# EAGLE board EEZ PSU consolidated r5B9 (EAGLE 6.1), part 1 of 4
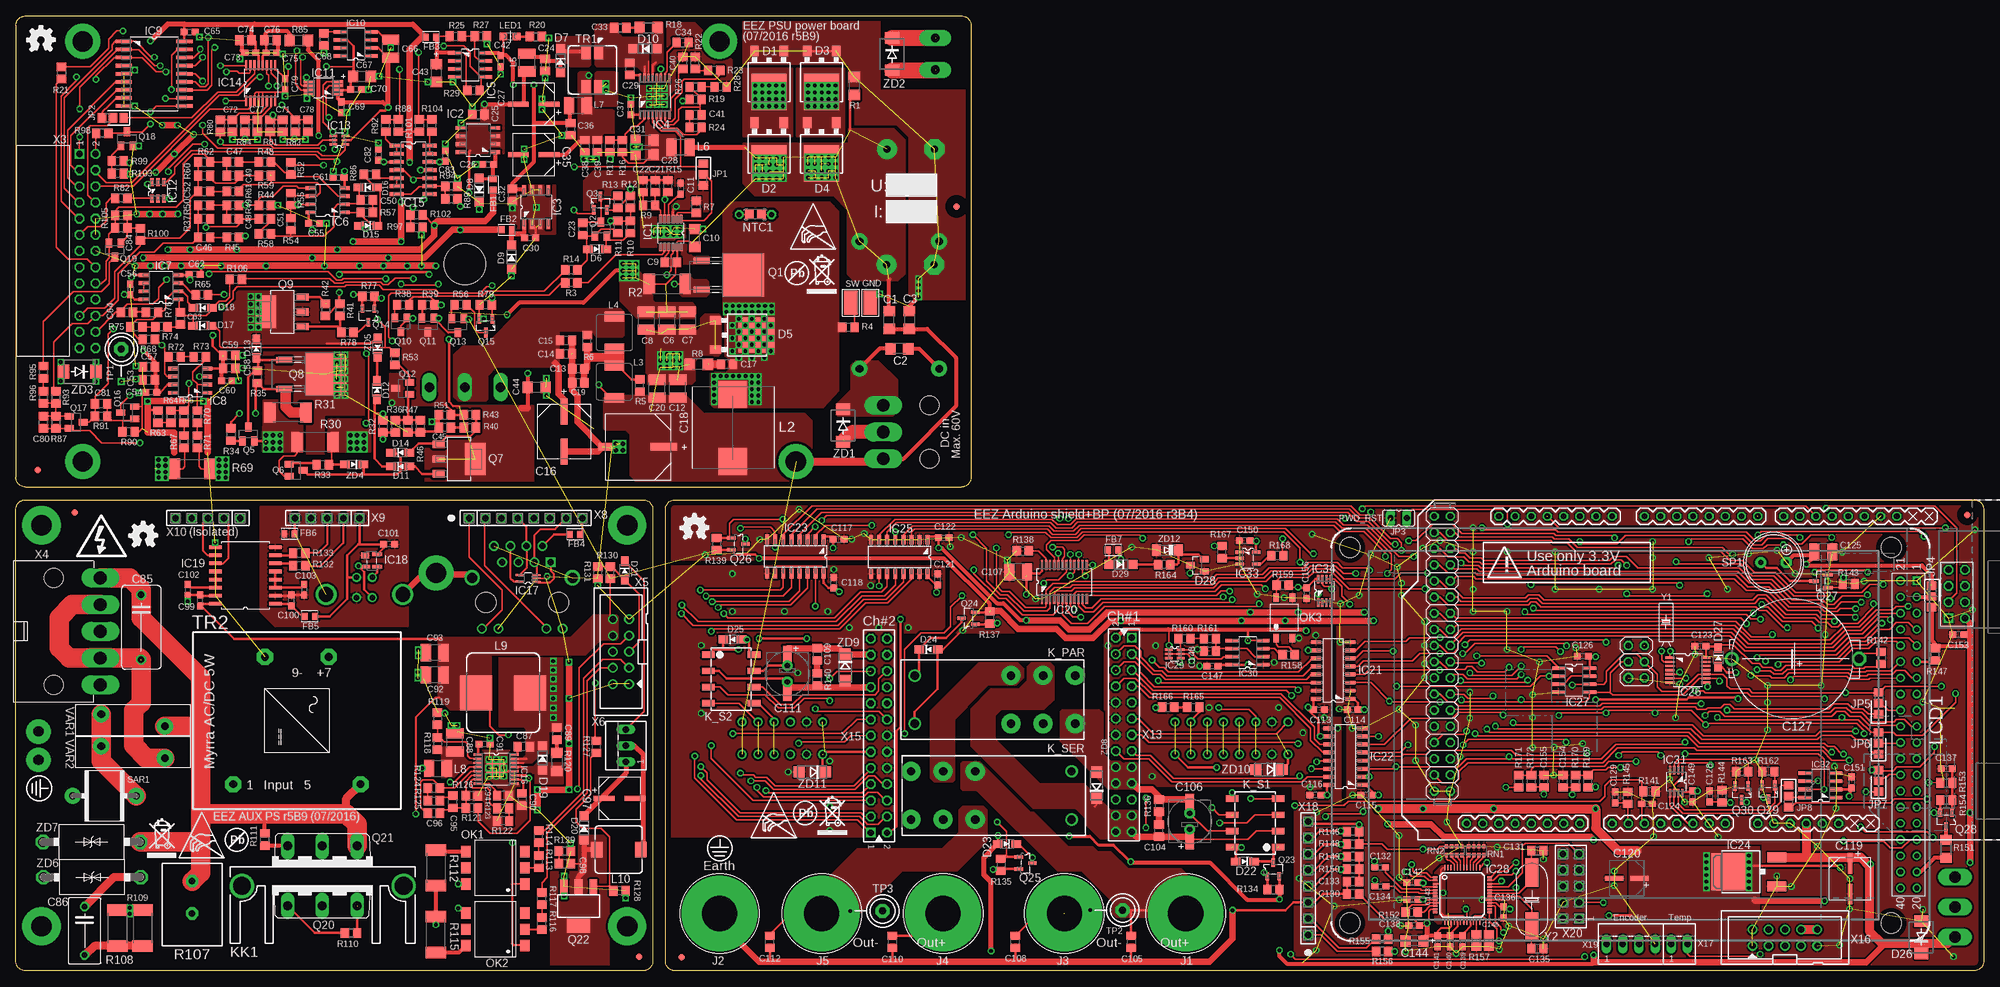
[diagram p12: board, top side]
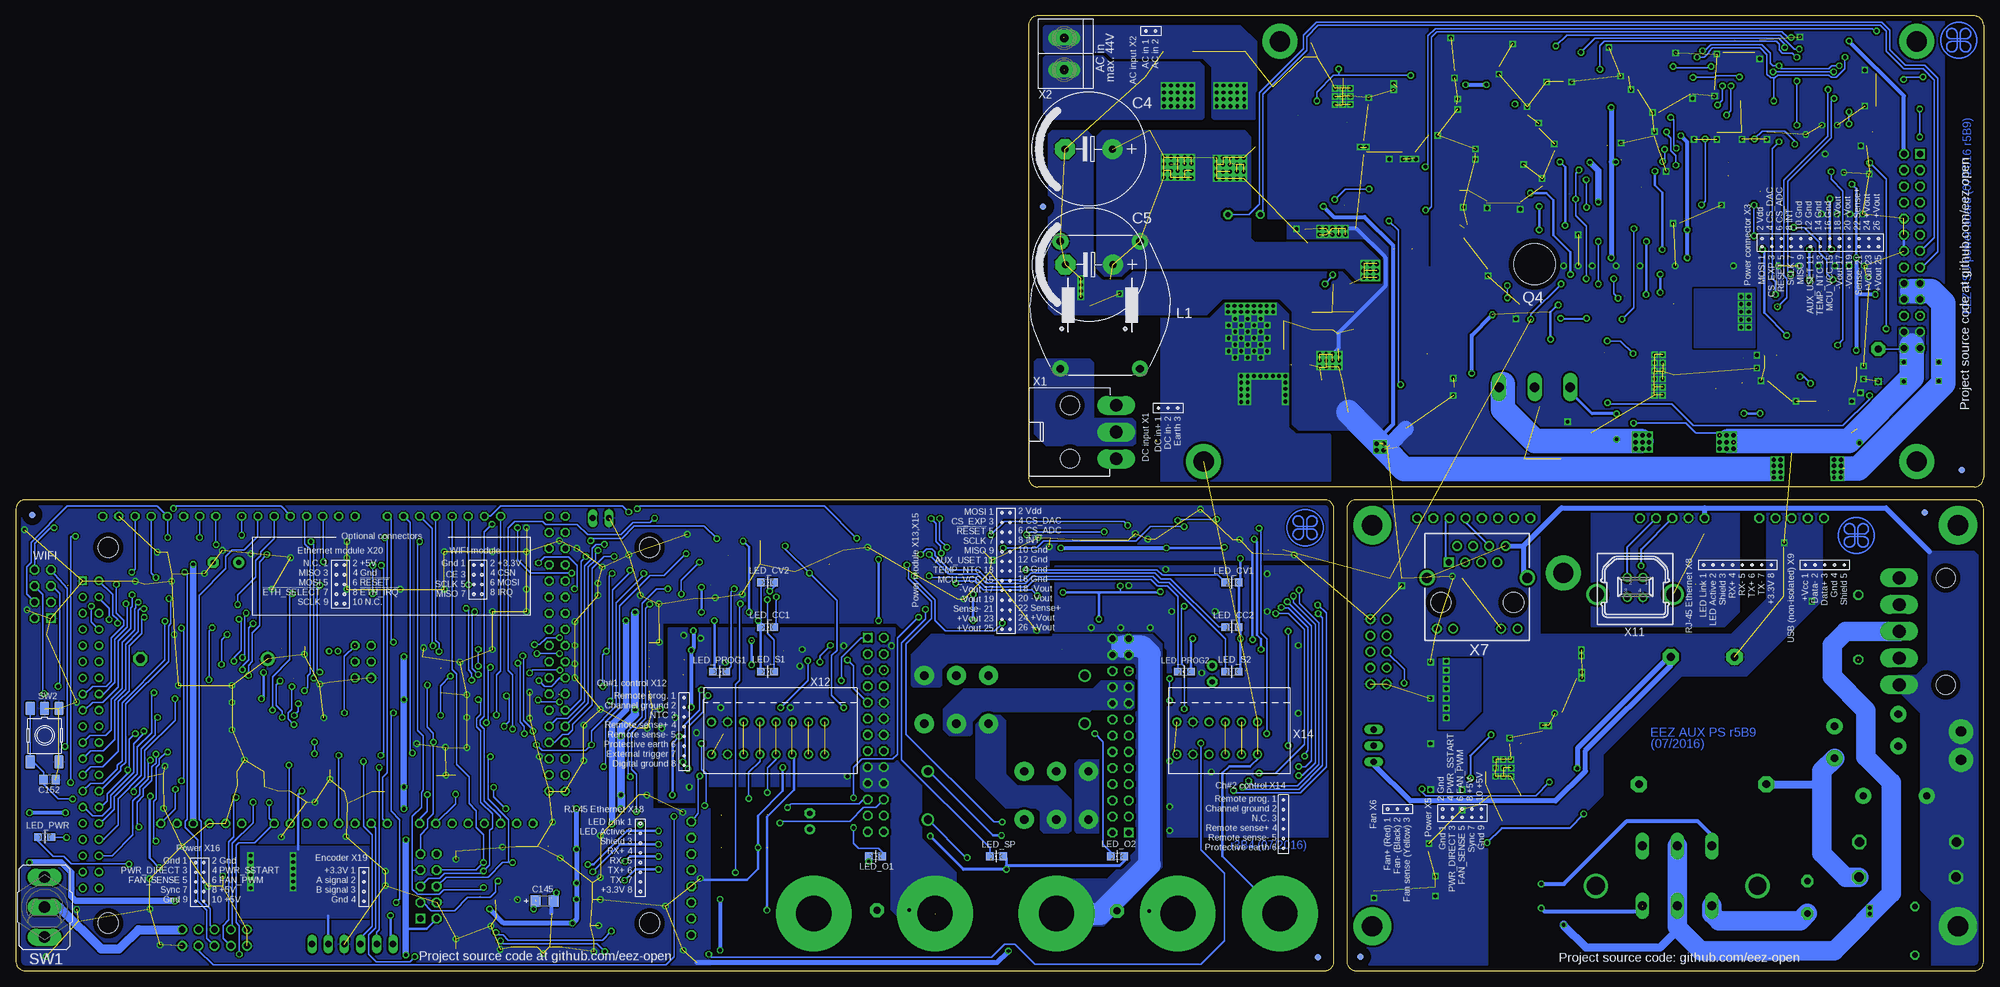
[diagram p13: board, bottom side, seen from below]

Size 309 x 150 mm. Coordinates in mm from the lower left corner, seen from the top.
Outline: 1.5,76 148.5,76 arc90 150,77.5 150,148.5 arc90 148.5,150 1.5,150 arc90 0,148.5 0,77.5 arc90 1.5,76
Outline: 1.5,74 98.5,74 arc-90 100,72.5 100,1.5 arc-90 98.5,0 1.5,0 arc-90 0,1.5 0,72.5 arc-90 1.5,74
Outline: 103.5,74 307.5,74 arc-90 309,72.5 309,1.5 arc-90 307.5,0 103.5,0 arc-90 102,1.5 102,72.5 arc-90 103.5,74
Copper layers (1*16): Top 0.035mm / dielectric 1.5mm / Bottom 0.035mm
Design rules: minimum track width 10mil, minimum drill 0.5mm, track to track 8mil, track to pad 8mil, pad to pad 8mil, via to via 8mil, smd to smd 8mil, copper to edge 30mil, drill to drill 8mil, minimum pad ring 10mil, minimum via ring 8mil, stop-mask expansion 4mil, vias tented up to drill 25mil, thermal gap 10mil
Net classes: 0 default: width 0.254 mm, drill 0.584 mm, clearance 0.254 mm; 1 dgnd: width 0.254 mm, drill 0.584 mm, clearance 0.254 mm; 2 gnd: width 0.254 mm, drill 0.584 mm, clearance 0.254 mm

## Footprints (pad centres in the part's own frame; a part is rotated, then mirrored left to right if it is on the bottom)
C1206 = smd 1.6 x 1.8: 1 -1.4,0; 2 1.4,0
ECAP7.5/18 = drill 1.1 pad 3.14: + -3.75,0 | drill 1.1 pad 3.14 octagon: - 3.75,0
C1210 = smd 1.6 x 2.7: 1 -1.4,0; 2 1.4,0
C0805 = smd 1.3 x 1.5: 1 -0.95,0; 2 0.95,0
C0603 = smd 1.1 x 1: 1 -0.85,0; 2 0.85,0
CAPAE830X1050N = smd 4.064 x 1.092: 1 -3.124,0; 2 3.124,0
PANASONIC_F = smd 4.166 x 1.194: 1 -4.064,0; 2 4.064,0
CAPAE660X610N = smd 3.251 x 0.762: 1 -2.413,0; 2 2.413,0
EC1206 = smd 1.6 x 1.8: + -1.4,0; - 1.4,0
C102-064X133 = drill 1.016 octagon: 1 -5.08,0; 2 5.08,0
C075-052X106 = drill 0.914 octagon: 1 -3.81,0; 2 3.81,0
CAPAE660X610N_COMBO2 = smd 3.6 x 1.4: 1 -2.6,0; 2 2.5,0 | drill 0.813 pad 1.6: 1.1 -1.27,0 | drill 0.813 pad 1.6 octagon: 2.1 1.27,0
PANASONIC_C = smd 2.87 x 0.762: 1 -1.981,0; 2 1.981,0
SG-R20MM = drill 1.3 pad 2.184 octagon: 1 10.389,0 | drill 1.3 pad 2.184: 2 -9.601,0
TO252@1 = smd 1.3 x 1.7: 1 -2.285,-5.49; 2 2.285,-5.49 | smd 5.5 x 5.7: 3 0,0.95
TO252 = smd 1.3 x 1.7: 1 -2.285,-5.49; 2 2.285,-5.49 | smd 5.5 x 5.7: 3 0,0.95
SOD323-W = smd 1.5 x 1.2: A 1.45,0; C -1.45,0
SOD123 = smd 1.4 x 1.4: A 1.9,0; C -1.9,0
DO214AA = smd 1.8 x 2.2: A 2.55,0; C -2.55,0
SOT23 = smd 1 x 1.4: 1 -0.95,-1.1; 2 0.95,-1.1; 3 0,1.1
BEAD0603 = smd 1 x 1.1: P$1 -0.85,0; P$2 0.85,0
FIDUCIAL_DUAL = smd 1.016 x 1.016 bottom: B 0,0 | smd 1.016 x 1.016: T 0,0
S1751-46R = smd 3.7 x 2.1: P$1 0,0
LTC_05-08-1666 = smd 1.27 x 0.457: 1 -2.235,1.63; 2 -2.235,0.98; 3 -2.235,0.33; 4 -2.235,-0.33; 5 -2.235,-0.98; 6 -2.235,-1.63; 7 2.235,-1.63; 8 2.235,-0.98; 9 2.235,-0.33; 10 2.235,0.33; 11 2.235,0.98; 12 2.235,1.63 | smd 1.753 x 2.946: TP 0,0
SOIC127P600X173-8N = smd 1.55 x 0.6: 1 -2.7,1.9; 2 -2.7,0.63; 3 -2.7,-0.64; 4 -2.7,-1.91; 5 2.7,-1.91; 6 2.7,-0.64; 7 2.7,0.63; 8 2.7,1.9
SOP65P640X110-16N = smd 1.422 x 0.356: 1 -2.845,2.286; 2 -2.845,1.626; 3 -2.845,0.965; 4 -2.845,0.33; 5 -2.845,-0.33; 6 -2.845,-0.965; 7 -2.845,-1.626; 8 -2.845,-2.286; 9 2.845,-2.286; 10 2.845,-1.626; 11 2.845,-0.965; 12 2.845,-0.33; 13 2.845,0.33; 14 2.845,0.965; 15 2.845,1.626; 16 2.845,2.286
SOIC127P600X175-8N = smd 1.981 x 0.559: 1 -2.464,1.905; 2 -2.464,0.635; 3 -2.464,-0.635; 4 -2.464,-1.905; 5 2.464,-1.905; 6 2.464,-0.635; 7 2.464,0.635; 8 2.464,1.905
SOIC127P1030X265-18N = smd 2.54 x 0.559: 1 -4.775,5.08; 2 -4.775,3.81; 3 -4.775,2.54; 4 -4.775,1.27; 5 -4.775,0; 6 -4.775,-1.27; 7 -4.775,-2.54; 8 -4.775,-3.81; 9 -4.775,-5.08; 10 4.775,-5.08; 11 4.775,-3.81; 12 4.775,-2.54; 13 4.775,-1.27; 14 4.775,0; 15 4.775,1.27; 16 4.775,2.54; 17 4.775,3.81; 18 4.775,5.08
DGK8-M = smd 1.727 x 0.483: 1 -2.235,0.965; 2 -2.235,0.33; 3 -2.235,-0.33; 4 -2.235,-0.965; 5 2.235,-0.965; 6 2.235,-0.33; 7 2.235,0.33; 8 2.235,0.965
SOT95P280X145-6N = smd 1.27 x 0.559: 1 -1.295,0.94; 2 -1.295,0; 3 -1.295,-0.94; 4 1.295,-0.94; 5 1.295,0; 6 1.295,0.94
SOT65P210X110-6N = smd 1.168 x 0.356: 1 -0.94,0.66; 2 -0.94,0; 3 -0.94,-0.66; 4 0.94,-0.66; 5 0.94,0; 6 0.94,0.66
PW(R-PDSO-G16) = smd 1.6 x 0.35: 1 -2.8,2.3; 2 -2.8,1.65; 3 -2.8,1; 4 -2.8,0.35; 5 -2.8,-0.3; 6 -2.8,-0.95; 7 -2.8,-1.6; 8 -2.8,-2.25; 9 2.8,-2.25; 10 2.8,-1.6; 11 2.8,-0.95; 12 2.8,-0.3; 13 2.8,0.35; 14 2.8,1; 15 2.8,1.65; 16 2.8,2.3
SOIC127P600X175-14N = smd 2.2 x 0.6: 1 -2.591,3.81; 2 -2.591,2.54; 3 -2.591,1.27; 4 -2.591,0; 5 -2.591,-1.27; 6 -2.591,-2.54; 7 -2.591,-3.81; 8 2.591,-3.81; 9 2.591,-2.54; 10 2.591,-1.27; 11 2.591,0; 12 2.591,1.27; 13 2.591,2.54; 14 2.591,3.81
SOP65P640X110-17N = smd 1.422 x 0.356: 1 -2.845,2.286; 2 -2.845,1.626; 3 -2.845,0.965; 4 -2.845,0.33; 5 -2.845,-0.33; 6 -2.845,-0.965; 7 -2.845,-1.626; 8 -2.845,-2.286; 9 2.845,-2.286; 10 2.845,-1.626; 11 2.845,-0.965; 12 2.845,-0.33; 13 2.845,0.33; 14 2.845,0.965; 15 2.845,1.626; 16 2.845,2.286 | smd 2.997 x 2.997: TP 0,0
SOT50P280X60-5N = smd 1.118 x 0.254: 1 -1.372,0.508; 2 -1.372,0; 3 -1.372,-0.508 | smd 1.118 x 0.305: 4 1.372,-0.508; 5 1.372,0.508
SOP192P292X122-4N = smd 0.94 x 1.321: 1 -0.762,-1.016 | smd 0.559 x 1.575: 2 0.965,-1.016; 3 0.965,0.889; 4 -0.965,0.889
SOIC-16W = smd 1.981 x 0.559: 1 -4.699,4.445; 2 -4.699,3.175; 3 -4.699,1.905; 4 -4.699,0.635; 5 -4.699,-0.635; 6 -4.699,-1.905; 7 -4.699,-3.175; 8 -4.699,-4.445; 9 4.699,-4.445; 10 4.699,-3.175; 11 4.699,-1.905; 12 4.699,-0.635; 13 4.699,0.635; 14 4.699,1.905; 15 4.699,3.175; 16 4.699,4.445
SOP63P600X175-24N = smd 1.6 x 0.356: 1 -2.667,3.505; 2 -2.667,2.845; 3 -2.667,2.235; 4 -2.667,1.575; 5 -2.667,0.965; 6 -2.667,0.305; 7 -2.667,-0.305; 8 -2.667,-0.965; 9 -2.667,-1.575; 10 -2.667,-2.235; 11 -2.667,-2.845; 12 -2.667,-3.505; 13 2.667,-3.505; 14 2.667,-2.845; 15 2.667,-2.235; 16 2.667,-1.575; 17 2.667,-0.965; 18 2.667,-0.305; 19 2.667,0.305; 20 2.667,0.965; 21 2.667,1.575; 22 2.667,2.235; 23 2.667,2.845; 24 2.667,3.505
SOIC-16 = smd 1.549 x 0.61: 1 -2.692,4.445; 2 -2.692,3.175; 3 -2.692,1.905; 4 -2.692,0.635; 5 -2.692,-0.635; 6 -2.692,-1.905; 7 -2.692,-3.175; 8 -2.692,-4.445; 9 2.692,-4.445; 10 2.692,-3.175; 11 2.692,-1.905; 12 2.692,-0.635; 13 2.692,0.635; 14 2.692,1.905; 15 2.692,3.175; 16 2.692,4.445
DPACK = smd 1.6 x 3: 1 -2.28,-4.8; 3 2.28,-4.8 | smd 5.8 x 6.2: 4 0,2.38
SOP65P640X120-14N = smd 1.473 x 0.356: 1 -2.819,1.956; 2 -2.819,1.295; 3 -2.819,0.66; 4 -2.819,0; 5 -2.819,-0.66; 6 -2.819,-1.295; 7 -2.819,-1.956; 8 2.819,-1.956; 9 2.819,-1.295; 10 2.819,-0.66; 11 2.819,0; 12 2.819,0.66; 13 2.819,1.295; 14 2.819,1.956
TQFP48-7X7 = smd 0.85 x 0.32: 1 -4.275,2.75; 2 -4.275,2.25; 3 -4.275,1.75; 4 -4.275,1.25; 5 -4.275,0.75; 6 -4.275,0.25; 7 -4.275,-0.25; 8 -4.275,-0.75; 9 -4.275,-1.25; 10 -4.275,-1.75; 11 -4.275,-2.25; 12 -4.275,-2.75; 25 4.275,-2.75; 26 4.275,-2.25; 27 4.275,-1.75; 28 4.275,-1.25; 29 4.275,-0.75; 30 4.275,-0.25; 31 4.275,0.25; 32 4.275,0.75; 33 4.275,1.25; 34 4.275,1.75; 35 4.275,2.25; 36 4.275,2.75 | smd 0.32 x 0.85: 13 -2.75,-4.275; 14 -2.25,-4.275; 15 -1.75,-4.275; 16 -1.25,-4.275; 17 -0.75,-4.275; 18 -0.25,-4.275; 19 0.25,-4.275; 20 0.75,-4.275; 21 1.25,-4.275; 22 1.75,-4.275; 23 2.25,-4.275; 24 2.75,-4.275; 37 2.75,4.275; 38 2.25,4.275; 39 1.75,4.275; 40 1.25,4.275; 41 0.75,4.275; 42 0.25,4.275; 43 -0.25,4.275; 44 -0.75,4.275; 45 -1.25,4.275; 46 -1.75,4.275; 47 -2.25,4.275; 48 -2.75,4.275
SOP65P400X130-8N = smd 1.321 x 0.356: 1 -1.829,0.965; 2 -1.829,0.33; 3 -1.829,-0.33; 4 -1.829,-0.965; 5 1.829,-0.965; 6 1.829,-0.33; 7 1.829,0.33; 8 1.829,0.965
SOT95P280X145-5N = smd 1.27 x 0.559: 1 -1.295,0.94; 2 -1.295,0; 3 -1.295,-0.94; 4 1.295,-0.94; 5 1.295,0.94
BP_5_12 = drill 5.5 pad 11.9: P$1 0,0
A0R-JMP = smd 1.5 x 1.3: 1 0,1.7; 2 0,0; 3 0,-1.7
JP1 = drill 0.914 long: 1 0,-1.27; 2 0,1.27
RT-C/016A5_ROUND = drill 1.3 pad 3: 11A 8.83,3.78; 11B 8.83,-3.78; 12A 3.79,3.78; 12B 3.79,-3.78; 14A 13.87,3.78; 14B 13.87,-3.78 | drill 1.3: A1 -11.33,-3.78; A2 -11.33,3.78
G6K-2F = smd 1 x 2: 1 -3.81,-3.6; 2 -1.27,-3.6; 3 1.27,-3.6; 4 3.81,-3.6; 5 3.81,3.6; 6 1.27,3.6; 7 -1.27,3.6; 8 -3.81,3.6
SK145 = drill 2.8: 1 -12.7,0; 2 12.7,0
RN114 = drill 1.2 pad 2.54: 1 -10,6.25; 2 -10,-6.25; 3 10,-6.25; 4 10,6.25
WE-HCI_1350/1365 = smd 4.25 x 4.5: 1 -5.25,0; 2 5.27,0
IHLP-2020BZ-11 = smd 3.048 x 1.524: 1 0,2.515; 2 0,-2.515
L1210 = smd 1.6 x 2.7: 1 -1.4,0; 2 1.4,0
MSS1278 = smd 5.5 x 5: 1 0,4.25; 2 0,-4.25
DE0704 = smd 2.5 x 1.8: 1 0,3.45; 2 0,-3.45
LCD_TFT_320QVT_MIRROR = drill 0.8 square: 1 48.26,0 | drill 0.8: 2 45.72,0; 3 43.18,0; 4 40.64,0; 5 38.1,0; 6 35.56,0; 7 33.02,0; 8 30.48,0; 9 27.94,0; 10 25.4,0; 11 22.86,0; 12 20.32,0; 13 17.78,0; 14 15.24,0; 15 12.7,0; 16 10.16,0; 17 7.62,0; 18 5.08,0; 19 2.54,0; 20 0,0; 21 48.26,2.54; 22 45.72,2.54; 23 43.18,2.54; 24 40.64,2.54; 25 38.1,2.54; 26 35.56,2.54; 27 33.02,2.54; 28 30.48,2.54; 29 27.94,2.54; 30 25.4,2.54; 31 22.86,2.54; 32 20.32,2.54; 33 17.78,2.54; 34 15.24,2.54; 35 12.7,2.54; 36 10.16,2.54; 37 7.62,2.54; 38 5.08,2.54; 39 2.54,2.54; 40 0,2.54 | hole 3.2: -5.5,4; 53.5,4; -5.5,89; 53.5,89
LED_0805 = smd 1.2 x 1.2: A 0,-1.05; C 0,1.05
ARDUINO+ICSP_MIRROR = drill 0.9 octagon: 0 63.5,2.54; 1 60.96,2.54; 2 58.42,2.54; 3 55.88,2.54; 3.3V 35.56,50.8; 4 53.34,2.54; 5 50.8,2.54; 5V 38.1,50.8; 5V(1) 93.98,2.54; 5V(2) 96.52,2.54; 6 48.26,2.54; 7 45.72,2.54; 8 41.656,2.54; 9 39.116,2.54; 10 36.576,2.54; 11 34.036,2.54; 12 31.496,2.54; 13 28.956,2.54; 14 68.58,2.54; 15 71.12,2.54; 16 73.66,2.54; 17 76.2,2.54; 18 78.74,2.54; 19 81.28,2.54; 20 83.82,2.54; 21 86.36,2.54; 22 93.98,5.08; 23 96.52,5.08; 24 93.98,7.62; 25 96.52,7.62; 26 93.98,10.16; 27 96.52,10.16; 28 93.98,12.7; 29 96.52,12.7; 30 93.98,15.24; 31 96.52,15.24; 32 93.98,17.78; 33 96.52,17.78; 34 93.98,20.32; 35 96.52,20.32; 36 93.98,22.86; 37 96.52,22.86; 38 93.98,25.4; 39 96.52,25.4; 40 93.98,27.94; 41 96.52,27.94; 42 93.98,30.48; 43 96.52,30.48; 44 93.98,33.02; 45 96.52,33.02; 46 93.98,35.56; 47 96.52,35.56; 48 93.98,38.1; 49 96.52,38.1; 50 93.98,40.64; 51 96.52,40.64; 52 93.98,43.18; 53 96.52,43.18; A0 50.8,50.8; A1 53.34,50.8; A2 55.88,50.8; A3 58.42,50.8; A4 60.96,50.8; A5 63.5,50.8; A6 66.04,50.8; A7 68.58,50.8; A8 73.66,50.8; A9 76.2,50.8; A10 78.74,50.8; A11 81.28,50.8; A12 83.82,50.8; A13 86.36,50.8; A14 88.9,50.8; A15 91.44,50.8; AREF 23.876,2.54; GND 26.416,2.54; GND1 40.64,50.8; GND2 43.18,50.8; GND3 93.98,45.72; GND4 96.52,45.72; ICSP_+5V 66.04,22.86; ICSP_MISO 63.5,22.86; ICSP_MOSI 66.04,25.4; ICSP_RESET 63.5,27.94; ICSP_SCK 63.5,25.4; RESET 33.02,50.8; VIN 45.72,50.8 | drill 1.016 octagon: ICSP_GND 66.04,27.94
R_0204/5+0805 = smd 1.3 x 1.5: 1 -0.95,0; 2 0.95,0 | drill 0.813 octagon: 1.1 -2.54,0 | drill 0.8 pad 1.422 octagon: 2.1 2.54,0
DIL6-SMD = smd 1.78 x 1.52: 1 -2.54,-4.645; 2 0,-4.645; 3 2.54,-4.645; 4 2.54,4.645; 5 0,4.645; 6 -2.54,4.645
HCPL-181 = smd 0.889 x 1.27: 1 -1.27,-3.175; 2 1.27,-3.175; 3 1.27,3.175; 4 -1.27,3.175
TO229P990X239-3N = smd 0.94 x 2.489: 1 -2.286,-6.401; 3 2.286,-6.401 | smd 6.731 x 6.528: 2 0,0.152
SOT23-BEC = smd 1 x 1.4: B -0.95,-1.1; C 0,1.1; E 0.95,-1.1
SOT103P240X110-3N = smd 1.524 x 0.559: 1 -1.079,1.016; 2 -1.079,-1.016; 3 1.079,0
TO247BH-CLR = drill 1.499 long: D 0,-19.304; G -5.588,-19.304; S 5.588,-19.304 | hole 6.5: 0,0
SOT230P700X180-4N = smd 1.905 x 1.143: 1 -3.2,2.311; 2 -3.2,0; 3 -3.2,-2.311 | smd 3.175 x 5.08: 4 2.565,0
SOT95P237X112-3N = smd 1.321 x 0.559: 1 -1.092,0.94; 2 -1.092,-0.94; 3 1.092,0
TOP3S-1 = drill 1.397 long: A1 -5.461,-3.175; A2 0,-3.175; G 5.461,-3.175
SOT223 = smd 1.219 x 2.235: 1 -2.311,-3.099; 2 0,-3.099; 3 2.311,-3.099 | smd 3.6 x 2.2: 4 0,3.099
R1206 = smd 1.6 x 1.803: 1 -1.422,0; 2 1.422,0
R2512 = smd 1.8 x 3.2: 1 -2.8,0; 2 2.8,0
R0805 = smd 1.3 x 1.5: 1 -0.95,0; 2 0.95,0
R_0913 = drill 1.016 pad 1.93 octagon: 1 -3.556,0; 2 1.524,0
CAY16 = smd 0.5 x 0.65: 1 -1.2,-0.675; 2 -0.4,-0.675; 3 0.4,-0.675; 4 1.2,-0.675; 5 1.2,0.675; 6 0.4,0.675; 7 -0.4,0.675; 8 -1.2,0.675
SAR = drill 1.1 pad 2.54: P$1 0,0; P$2 10,0
SHORT_NOHOLE = smd 0.5 x 0.25 bottom: P$1 0,0.117; P$2 0,-0.117
LD-BZEN-0903 = drill 0.8 pad 1.778 octagon: +B 2,0 | drill 0.8 pad 1.778: -B -2,0
M9040P = drill 1.803 long: 1 0,4.699; 2 0,0; 3 0,-4.699
TACTM-6XN = smd 2.1 x 1.4: 1 -4.2,2.25; 2 4.2,2.25; 3 -4.2,-2.25; 4 4.2,-2.25; 5 -4.2,0
TP_1.1MM = drill 0.6 square: GND 5.08,0 | drill 1.1 pad 2.184 octagon: TIP 0,0
SRF0703 = smd 1.4 x 2.1: 1 1,2.7; 2 -1,2.7; 3 -1,-2.7; 4 1,-2.7
PCB_ACDC_MYRRA_5W = drill 1.2 pad 2.54 octagon: 1 10,-10; 5 10,10; 7 -10,5; 9 -10,-5
VARISTOR = drill 1.2 pad 2.54: P$1 -5,0.95; P$2 5,-0.95
MOD-NRF24L01_MIRROR = drill 1 pad 1.5 square: 1 0,0 | drill 1 pad 1.5 octagon: 2 2.54,0; 3 0,2.54; 4 2.54,2.54; 5 0,5.08; 6 2.54,5.08; 7 0,7.62; 8 2.54,7.62
MINIFIT_6659-3 = drill 2 pad 2.54 long: 1 0,0; 2 0,-4.2; 3 0,-8.4 | hole 3: -7.3,0; -7.3,-8.4
TBLOCK5.0_2 = drill 1.35 pad 2.54 long: 1 0,0; 2 0,-5
SSW-113-02-T-D-RA = drill 1 pad 1.5 square: 1 30.48,2.54 | drill 1 pad 1.5 octagon: 2 30.48,0; 3 27.94,2.54; 4 27.94,0; 5 25.4,2.54; 6 25.4,0; 7 22.86,2.54; 8 22.86,0; 9 20.32,2.54; 10 20.32,0; 11 17.78,2.54; 12 17.78,0; 13 15.24,2.54; 14 15.24,0; 15 12.7,2.54; 16 12.7,0; 17 10.16,2.54; 18 10.16,0; 19 7.62,2.54; 20 7.62,0; 21 5.08,2.54; 22 5.08,0; 23 2.54,2.54; 24 2.54,0; 25 0,2.54; 26 0,0
MINIFIT_6659-5 = drill 2 pad 2.54 long: 1 0,0; 2 0,-4.2; 3 0,-8.4; 4 0,-12.6; 5 0,-16.8 | hole 3: -7.3,0; -7.3,-16.8
IDC-10PIN = drill 1 pad 1.422: 1 -5.08,-1.27; 2 -5.08,1.27; 3 -2.54,-1.27; 4 -2.54,1.27; 5 0,-1.27; 6 0,1.27; 7 2.54,-1.27; 8 2.54,1.27; 9 5.08,-1.27; 10 5.08,1.27
22-23-2031 = drill 1 long: 1 -2.54,0; 2 0,0; 3 2.54,0
RJ45-VERT = drill 1 square: 1 4.445,-5.08 | drill 1: 2 3.175,-7.62; 3 1.905,-5.08; 4 0.635,-7.62; 5 -0.635,-5.08; 6 -1.905,-7.62; 7 -3.175,-5.08; 8 -4.445,-7.62; 9 6.325,5.38; 10 3.785,5.38; 11 -3.785,5.38; 12 -6.325,5.38 | drill 1.6: SH1 7.875,-2.62; SH2 -7.875,-2.62 | hole 3.2: -5.715,1.27; 5.715,1.27
SSW-108-02-S-S = drill 1 pad 1.5 octagon: 1 -8.89,0; 2 -6.35,0; 3 -3.81,0; 4 -1.27,0; 5 1.27,0; 6 3.81,0; 7 6.35,0; 8 8.89,0
SSW-105-02-S-S = drill 1 pad 1.5 octagon: 1 -5.08,0; 2 -2.54,0; 3 0,0; 4 2.54,0; 5 5.08,0
KUSBVX-BS1N = drill 0.9 pad 1.422: 1 1.25,2.7; 2 -1.25,2.7; 3 -1.25,-0.5; 4 1.25,-0.5 | drill 2.3 pad 2.7: M1 -6.02,0; M2 6.02,0
MC000006_MIRROR = drill 0.9: 1 0,0; 1.1 0,-5.08; 2 -2.54,0; 2.1 -2.54,-5.08; 3 -5.08,0; 3.1 -5.08,-5.08; 4 -7.62,0; 4.1 -7.62,-5.08; 5 -10.16,0; 5.1 -10.16,-5.08; 6 -12.7,0; 6.1 -12.7,-5.08; 7 -15.24,0; 7.1 -15.24,-5.08; 8 -17.78,0; 8.1 -17.78,-5.08
TSW-113-07-F-D = drill 1 pad 1.5 square: 1 30.48,0 | drill 1 pad 1.5 octagon: 2 30.48,2.54; 3 27.94,0; 4 27.94,2.54; 5 25.4,0; 6 25.4,2.54; 7 22.86,0; 8 22.86,2.54; 9 20.32,0; 10 20.32,2.54; 11 17.78,0; 12 17.78,2.54; 13 15.24,0; 14 15.24,2.54; 15 12.7,0; 16 12.7,2.54; 17 10.16,0; 18 10.16,2.54; 19 7.62,0; 20 7.62,2.54; 21 5.08,0; 22 5.08,2.54; 23 2.54,0; 24 2.54,2.54; 25 0,0; 26 0,2.54
MC000005_MIRROR = drill 0.9: 1 0,0; 1.1 0,-5.08; 2 -2.54,0; 2.1 -2.54,-5.08; 3 -5.08,0; 3.1 -5.08,-5.08; 4 -7.62,0; 4.1 -7.62,-5.08; 5 -10.16,0; 5.1 -10.16,-5.08; 6 -12.7,0; 6.1 -12.7,-5.08
22-23-2021 = drill 1 long: 1 -1.27,0; 2 1.27,0
22-23-2041 = drill 1 long: 1 -3.81,0; 2 -1.27,0; 3 1.27,0; 4 3.81,0
SSW-105-02-S-D = drill 1 pad 1.5 square: 1 -5.08,-1.27 | drill 1 pad 1.5 octagon: 2 -5.08,1.27; 3 -2.54,-1.27; 4 -2.54,1.27; 5 0,-1.27; 6 0,1.27; 7 2.54,-1.27; 8 2.54,1.27; 9 5.08,-1.27; 10 5.08,1.27
R26_XTAL = drill 0.5: 1 -0.7,0; 2 0.7,0
HC-49/4H = smd 4.5 x 2: 1 -4.25,0; 2 4.25,0
DO201-BIDIR = drill 1.499 octagon: A 7.62,0; C -7.62,0
DO214AC = smd 1.8 x 1.7: A 2.05,0; C -2.05,0
MINIMELF = smd 1.4 x 1.8: A 1.7,0; C -1.7,0

## Placement (x,y rotation side)
C1  4n7/100V  [C1206]  137.15,102.23 90 top
C2  4n7/100V  [C1206]  138.73,97.73 180 top
C3  4n7/100V  [C1206]  140.32,102.23 270 top
C4  2m2  [ECAP7.5/18]  140.51,129.1 180 bottom
C5  2m2  [ECAP7.5/18]  140.45,110.93 180 bottom
C6  4u7  [C1210]  102.22,102.11 270 top
C7  4u7  [C1210]  105.46,102.11 270 top
C8  4u7  [C1210]  98.98,102.11 270 top
C9  470n  [C0805]  102.86,111.32 0 top
C10  1u/100V  [C1206]  106.6,115.13 90 top
C11  100n  [C0603]  104.38,122.87 270 top
C12  10u  [C1210]  103.93,91.44 90 top
C13  1u  [C0805]  88.31,94.55 180 top
C14  n.c.  [C0805]  86.41,96.9 0 top
C15  n.c.  [C0805]  86.41,99.06 0 top
C16  EEEFK1J470P  [CAPAE830X1050N]  86.09,84.71 270 top
C17  330p  [C0805]  111.68,95.25 180 top
C18  EEEFK1J101P  [PANASONIC_F]  97.71,82.3 180 top
C19  n.c.  [C0805]  88.31,92.39 0 top
C20  10u  [C1210]  100.7,91.44 90 top
C21  120p  [C0805]  100.44,123.25 90 top
C22  4n7  [C0805]  98.47,123.25 90 top
C23  470p  [C0805]  89.01,116.52 270 top
C24  2u2  [C0805]  83.11,142.3 270 top
C25  470n  [C0805]  72.63,134.49 0 top
C26  100n  [C0603]  74.15,126.68 0 top
C27  47u  [CAPAE660X610N]  81.33,136.14 180 top
C28  1u/100V  [C1206]  98.73,128.21 180 top
C29  22n  [C0805]  96.44,141.67 270 top
C30  100n  [C0603]  80.76,115.13 0 top
C31  1u/100V  [C1206]  98.73,130.43 180 top
C32  470n  [C0805]  77.96,121.86 270 top
C33  330p  [C0805]  94.92,148.15 0 top
C34  10n  [C0805]  104.7,145.8 0 top
C35  47u  [CAPAE660X610N]  81.33,128.21 180 top
C36  2u2  [C0805]  87.11,132.21 270 top
C37  100n  [C0603]  96.57,135.32 270 top
C38  2u2  [C0805]  89.33,129.54 270 top
C39  n.c.  [C0805]  91.3,129.54 270 top
C40  3n3  [C0805]  104.7,142.62 270 top
C41  1n  [C0805]  106.73,134.43 180 top
C42  100n  [C0603]  76.12,142.88 270 top
C43  4u7  [EC1206]  66.03,141.03 270 top
C44  1u/100V  [C1206]  81.77,91.69 0 top
C45  10n  [C0805]  67.36,85.34 180 top
C46  47p  [C0805]  29.58,115.19 0 top
C47  2n2  [C0805]  34.08,127.06 0 top
C48  2n2  [C0805]  34.08,118.11 0 top
C49  2n2  [C0805]  34.08,124.9 180 top
C50  120p  [C0805]  55.1,121.09 0 top
C51  2n2  [C0805]  39.1,118.11 0 top
C52  47p  [C0805]  29.58,122.42 0 top
C53  10n  [C0805]  20.88,92.87 0 top
C54  100n  [C0603]  21.26,90.87 180 top
C55  100n  [C0603]  46.85,117.41 180 top
C56  100n  [C0603]  17.96,107.06 270 top
C57  1u  [C0805]  20.89,94.85 0 top
C58  10n  [C0805]  33.51,94.68 180 top
C59  1u  [C0805]  33.51,96.66 180 top
C60  100n  [C0603]  33.13,92.71 0 top
C61  100n  [C0603]  50.66,124.65 0 top
C62  100n  [C0603]  28.05,109.41 180 top
C63  1n  [C0805]  25.83,102.49 90 top
C64  1n  [C0805]  17.45,103.44 0 top
C65  100n  [C0603]  27.29,147.45 0 top
C66  10u  [C1210]  58.85,144.84 90 top
C67  10u  [EC1206]  54.34,140.53 0 top
C68  1u  [C0805]  48.37,146.3 270 top
C69  100n  [C0603]  51.1,135.64 90 top
C70  100n  [C0603]  53.45,138.43 180 top
C71  3n3  [C0805]  41.9,132.72 90 top
C72  3n3  [C0805]  34.02,132.72 270 top
C73  100n  [C0603]  36.81,144.21 0 top
C74  1u  [C0805]  36.05,146.18 0 top
C75  100n  [C0603]  40.12,144.21 180 top
C76  1u  [C0805]  39.99,146.18 180 top
C77  3n3  [C0805]  37.96,132.72 90 top
C78  3n3  [C0805]  45.83,132.72 90 top
C79  100n  [C0603]  42.28,139.26 90 top
C80  10n  [C0805]  4.3,86.17 90 top
C81  2n2  [C0805]  13.38,89.09 180 top
C82  100n  [C0603]  56.94,128.21 270 top
C83  100n  [C0603]  67.42,128.02 270 top
C84  10n  [C0805]  16.56,116.71 180 top
C85  6n8 (X1)  [C102-064X133]  19.67,53.98 270 top
C86  47n/400V  [C075-052X106]  10.78,6.29 270 top
C87  22n  [C0805]  79.74,35.24 180 top
C88  4u7  [C1210]  68.95,35.88 90 top
C89  330p  [C0805]  84.95,37.27 270 top
C90  22n  [C0805]  79.49,26.92 270 top
C91  100n  [C0603]  73.58,35.62 180 top
C92  4u7  [C1210]  65.77,46.48 180 top
C93  4u7  [C1210]  65.77,49.97 180 top
C94  1n  [C0805]  76.5,27.56 180 top
C95  3n9  [C0805]  68.63,26.57 90 top
C96  180p  [C0805]  65.64,24.77 180 top
C97  100u  [CAPAE660X610N]  94.79,27.11 0 top
C98  47n  [C0805]  86.22,16.83 0 top
C99  100n  [C0603]  28.94,58.17 90 top
C100  100n  [C0603]  43.29,58.17 90 top
C101  100n  [C0603]  58.6,66.99 180 top
C102  100n  [C0603]  26.97,59.82 270 top
C103  100n  [C0603]  45.26,59.88 270 top
C104  470n  [C0805]  179.5,22.03 90 top
C105  4n7/200V  [C0805]  175.12,4.57 270 top
C106  EEEFK1J220P  [CAPAE660X610N_COMBO2]  184.33,23.5 90 top
C107  10u  [C1210]  157.4,62.67 180 top
C108  4n7/200V  [C0805]  156.96,4.57 90 top
C109  470n  [C0805]  125.84,49.72 270 top
C110  4n7/200V  [C0805]  137.65,4.57 270 top
C111  EEEFK1J220P  [CAPAE660X610N_COMBO2]  121.14,46.67 270 top
C112  4n7/200V  [C0805]  118.41,4.57 90 top
C113  100n  [C0603]  204.65,41.02 0 top
C114  100n  [C0603]  209.92,41.02 180 top
C115  100n  [C0603]  212.07,27.62 180 top
C116  100n  [C0603]  204.07,27.62 180 top
C117  100n  [C0603]  129.21,67.82 0 top
C118  100n  [C0603]  128.45,60.96 90 top
C119  47u  [CAPAE660X610N]  288.02,14.48 270 top
C120  10u  [PANASONIC_C]  252.97,14.54 180 top
C121  100n  [C0603]  144.76,61.47 90 top
C122  100n  [C0603]  145.72,68.01 0 top
C123  100n  [C0603]  264.53,50.99 0 top
C124  100n  [C0603]  256.14,26.23 180 top
C125  10u  [C1210]  283.83,65.79 180 top
C126  100n  [C0603]  246.05,49.4 180 top
C127  EECS5R5H105  [SG-R20MM]  279.07,49.02 0 top
C128  100n  [C0603]  265.99,27.43 270 top
C129  100n  [C0603]  251.13,27.24 270 top
C130  22n  [C0805]  209.98,12.06 180 top
C131  18p  [C0805]  238.94,18.86 0 top
C132  6n8  [C0603]  214.23,16.26 0 top
C133  10n  [C0805]  209.98,14.03 180 top
C134  6n8  [C0603]  214.3,13.27 0 top
C135  18p  [C0805]  238.94,3.49 0 top
C136  100n  [C0603]  233.6,9.21 90 top
C137  100n  [C0603]  303.2,31.75 0 top
C138  100n  [C0603]  219.57,7.11 180 top
C139  100n  [C0603]  227.19,4.64 270 top
C140  100n  [C0603]  225.22,4.64 270 top
C141  100n  [C0603]  223.25,4.64 270 top
C142  100n  [C0603]  219.31,13.84 180 top
C143  100n  [C0603]  219.31,11.18 180 top
C144  10u  [EC1206]  219.63,4.7 180 top
C145  4u7  [EC1206]  225.98,10.99 0 bottom
C146  10n  [C0805]  231.32,4.76 90 top
C147  100n  [C0603]  187.88,47.88 180 top
C148  47n  [C0805]  187.5,50.23 0 top
C149  100n  [C0603]  263.32,27.43 90 top
C150  100n  [C0603]  192.96,67.56 180 top
C151  100n  [C0603]  288.27,29.59 270 top
C152  47n  [C0805]  303.71,30.04 180 bottom
C153  100n  [C0603]  305.04,52.83 180 top
C154  10n  [C0805]  242.94,29.78 270 top
C155  10n  [C0805]  239.95,29.78 90 top
C156  100n  [C0603]  202.68,59.31 270 top
D1  STPS15H100  [TO252@1]  118.29,139 180 top
D2  STPS15H100  [TO252@1]  118.29,127.76 180 top
D3  STPS15H100  [TO252@1]  126.54,139 180 top
D4  STPS15H100  [TO252@1]  126.54,127.76 180 top
D5  STPS15H100  [TO252]  115.36,99.89 270 top
D6  BAS316  [SOD323-W]  91.23,113.35 180 top
D7  DFLS1100-7  [SOD123]  85.52,142.94 270 top
D8  SKL16  [SOD123]  72.76,122.62 90 top
D9  SKL16  [SOD123]  77.84,112.14 270 top
D10  DFLS1100-7  [SOD123]  98.79,144.84 0 top
D11  BAS316  [SOD323-W]  60.37,79.25 0 top
D12  BAS316  [SOD323-W]  56.69,91.25 270 top
D13  BAS316  [SOD323-W]  37.77,97.73 270 top
D14  BAS316  [SOD323-W]  60.37,81.41 0 top
D15  BAS316  [SOD323-W]  55.29,117.03 180 top
D16  BAS316  [SOD323-W]  55.23,123.06 0 top
D17  BAS316  [SOD323-W]  29.26,101.35 0 top
D18  BAS316  [SOD323-W]  29.32,104.14 0 top
D19  DFLS1100-7  [SOD123]  82.73,33.46 270 top
D20  SKL16  [SOD123]  89.2,22.48 270 top
D21  BAS316  [SOD323-W]  95.62,62.87 270 top
D22  BAS316  [SOD323-W]  193.03,17.17 180 top
D23  BAS316  [SOD323-W]  155.62,19.94 180 top
D24  BAS316  [SOD323-W]  143.3,50.48 0 top
D25  BAS316  [SOD323-W]  112.51,52.07 0 top
D26  SMBJ5.0A-TR  [DO214AA]  299.2,5.27 90 top
D27  BAS316  [SOD323-W]  267.32,49.21 270 top
D28  BAT54S  [SOT23]  185.53,63.69 90 top
D29  SKL16  [SOD123]  173.53,63.82 180 top
EEZ_SIGNATURE  SIGNATURESMALL  [SIGNATURE_5MM]  3.92,146.19 180 top
EEZ_SIGNATURE1  SIGNATURESMALL  [SIGNATURE_5MM]  19.98,68.4 180 top
EEZ_SIGNATURE2  SIGNATURESMALL  [SIGNATURE_5MM]  106.55,69.61 180 top
FB1  60R@100MHz  [BEAD0603]  74.98,123.51 270 top
FB2  60R@100MHz  [BEAD0603]  77.07,116.4 180 top
FB3  60R@100MHz  [BEAD0603]  65.2,146.69 180 top
FB4  60R@100MHz  [BEAD0603]  87.81,68.58 0 top
FB5  60R@100MHz  [BEAD0603]  46.15,55.69 180 top
FB6  60R@100MHz  [BEAD0603]  42.97,68.64 180 top
FB7  60R@100MHz  [BEAD0603]  172.32,66.1 180 top
FM1  FIDUCIAL_2  [FIDUCIAL_DUAL]  147.69,120.08 0 top
FM2  FIDUCIAL_2  [FIDUCIAL_DUAL]  3.41,78.68 0 top
FM3  FIDUCIAL_2  [FIDUCIAL_DUAL]  9.26,72.01 0 top
FM4  FIDUCIAL_2  [FIDUCIAL_DUAL]  97.84,2.22 0 top
FM5  FIDUCIAL_2  [FIDUCIAL_DUAL]  306.44,71.63 0 top
FM6  FIDUCIAL_2  [FIDUCIAL_DUAL]  104.51,2.16 0 top
GND  S1751-46R  [S1751-46R]  134.16,104.97 90 top
IC1  LTC3864EMSE#PBF  [LTC_05-08-1666]  102.86,115.89 270 top
IC2  MC79L05  [SOIC127P600X173-8N]  72.57,130.49 180 top
IC3  MC78L05  [SOIC127P600X173-8N]  81.71,119.95 90 top
IC4  LM5574MTX/NOPB  [SOP65P640X110-16N]  100.31,137.35 90 top
IC5  LP2951SO8  [SOIC127P600X175-8N]  71.36,142.3 0 top
IC6  TL072D  [SOIC127P600X173-8N]  48.94,121.03 180 top
IC7  TL072D  [SOIC127P600X173-8N]  22.78,107.38 180 top
IC8  OP27GSZ  [SOIC127P600X173-8N]  27.35,92.71 180 top
IC9  MCP23S08-E/SO  [SOIC127P1030X265-18N]  21.7,140.91 0 top
IC10  REF5025AIDG4  [SOIC127P600X175-8N]  53.39,145.61 180 top
IC11  DAC8552IDGKTG4  [DGK8-M]  48.31,138.68 180 top
IC12  ADG465SOT-23  [SOT95P280X145-6N]  22.34,122.62 90 top
IC13  TS5A9411DCKT  [SOT65P210X110-6N]  50.78,130.49 180 top
IC14  ADS1120IPWR  [PW(R-PDSO-G16)]  38.47,139.45 90 top
IC15  LP339D  [SOIC127P600X175-14N]  62.41,125.79 0 top
IC16  LM25575MH/NOPB  [SOP65P640X110-17N]  75.42,31.69 0 top
IC17  TPD4E002DRLR  [SOT50P280X60-5N]  80.44,61.66 180 top
IC18  TPD2E001DZDR  [SOP192P292X122-4N]  55.87,64.45 270 top
IC19  ADUM3160BRWZ  [SOIC-16W]  36.05,62.1 180 top
IC20  TLC5925IDBQR  [SOP63P600X175-24N]  164.64,61.09 90 top
IC21  Si8641EC-B-IS1  [SOIC-16]  206.87,47.18 180 top
IC22  SI8651EC-B-IS1  [SOIC-16]  208.77,33.66 180 top
IC23  SI8651EC-B-IS1  [SOIC-16]  122.41,65.09 270 top
IC24  LD1117ADT33TR  [DPACK]  271.7,15.56 90 top
IC25  Si8641EC-B-IS1  [SOIC-16]  138.73,65.02 270 top
IC26  PCA21125T/Q900/1,1  [SOP65P640X120-14N]  262.56,47.24 0 top
IC27  AT25256B-SSHL-B  [SOIC127P600X175-8N]  244.71,45.66 0 top
IC28  W5500  [TQFP48-7X7]  227.12,11.94 0 top
IC29  BC857BS  [SOT65P210X110-6N]  181.98,49.78 0 top
IC30  TLC555  [SOIC127P600X175-8N]  193.41,49.97 180 top
IC31  SN74LVC2G08DCTR  [SOP65P400X130-8N]  260.72,29.72 270 top
IC32  TPS3705-33D  [SOIC127P600X175-8N]  283.39,29.15 180 top
IC33  SN74LV1T34DBVR  [SOT95P280X145-5N]  193.47,64.83 0 top
IC34  SN74LVC2G02DCTR  [SOP65P400X130-8N]  205.47,59.69 90 top
J1  BS-244DSM-R  [BP_5_12]  183.7,9 0 top
J2  BS-244DSM-G  [BP_5_12]  110.5,9 0 top
J3  BS-244DSM-B  [BP_5_12]  164.65,9 0 top
J4  BS-244DSM-R  [BP_5_12]  145.6,9 0 top
J5  BS-244DSM-B  [BP_5_12]  126.55,9 0 top
JP1  0R-JUMPA  [A0R-JMP]  107.94,125.09 180 top
JP2  0R-JUMPA  [A0R-JMP]  15.23,133.99 90 top
JP3  826926-2  [JP1]  217.16,71.12 90 top
JP4  0R-JUMPA  [A0R-JMP]  300.85,58.8 0 top
JP5  0R-JUMPA  [A0R-JMP]  292.53,42.04 0 top
JP6  0R-JUMPA  [A0R-JMP]  292.53,35.75 0 top
JP7  0R-JUMPA  [A0R-JMP]  292.53,29.84 0 top
JP8  0R-JUMPA  [A0R-JMP]  278.37,27.43 180 top
K_PAR  RT424005  [RT-C/016A5_ROUND]  152.48,42.61 0 top
K_S1  G6K-2F-5DC  [G6K-2F]  194.61,23.24 90 top
K_S2  G6K-2F-5DC  [G6K-2F]  112.32,45.85 270 top
K_SER  RT424005  [RT-C/016A5_ROUND]  154.45,27.56 180 top
KK1  SK 145/37,5  [SK145]  48.18,13.34 180 top
L1  RN114-4/02  [RN114]  138.73,104.58 90 bottom
L2  7443551331  [WE-HCI_1350/1365]  112.57,85.28 270 top
L3  IHLP2020CZER3R3M11  [IHLP-2020BZ-11]  93.97,92.52 180 top
L4  IHLP2020CZER3R3M11  [IHLP-2020BZ-11]  93.97,100.27 180 top
L5  2u2  [L1210]  80.25,142.68 270 top
L6  2u2  [L1210]  104.38,129.35 180 top
L7  2u2  [L1210]  88.25,135.89 180 top
L8  2u2  [L1210]  66.28,31.81 0 top
L9  100uH  [MSS1278]  76.5,43.69 270 top
L10  470u  [DE0704]  94.66,19.05 270 top
LCD1  TFT_320QVT  [LCD_TFT_320QVT_MIRROR]  298.5,13 90 top
LED1  HSMY-C170  [LED_0805]  77.58,146.75 270 top
LED_CC1  HSMH-C170  [LED_0805]  191,54 270 bottom
LED_CC2  HSMH-C170  [LED_0805]  118,54 90 bottom
LED_CV1  HSMY-C170  [LED_0805]  118,61 90 bottom
LED_CV2  HSMY-C170  [LED_0805]  191,61 270 bottom
LED_O1  HSMG-C170  [LED_0805]  174,18 270 bottom
LED_O2  HSMG-C170  [LED_0805]  136,18 90 bottom
LED_PROG1  HSMH-C170  [LED_0805]  198.5,47 270 bottom
LED_PROG2  HSMH-C170  [LED_0805]  125.5,47 90 bottom
LED_PWR  HSMD-C170  [LED_0805]  304.5,21 270 bottom
LED_S1  HSMY-C170  [LED_0805]  191,47 270 bottom
LED_S2  HSMY-C170  [LED_0805]  118,47 90 bottom
LED_SP  HSMH-C170  [LED_0805]  155,18 90 bottom
MCU  Arduino Due  [ARDUINO+ICSP_MIRROR]  319.25,73.95 180 top
NTC1  NTCS0805E3103JMT  [R_0204/5+0805]  116.13,118.81 0 top
OK1  MOC3052  [DIL6-SMD]  75.3,16.19 90 top
OK2  MOC3062  [DIL6-SMD]  75.3,6.54 90 top
OK3  HCPL-181  [HCPL-181]  199.18,55.44 0 top
Q1  IRFR5305  [TO229P990X239-3N]  114.09,109.28 270 top
Q2  MMBT5401  [SOT23-BEC]  91.87,116.52 0 top
Q3  2N7002  [SOT103P240X110-3N]  91.81,120.59 90 top
Q4  IRFP250N  [TO247BH-CLR]  70.5,111 0 top
Q5  BC857C  [SOT23-BEC]  36.5,84.33 0 top
Q6  BC846C  [SOT23-BEC]  43.99,78.61 270 top
Q7  BCP56-16.115  [SOT230P700X180-4N]  69.58,80.39 0 top
Q8  IRFR5410  [TO229P990X239-3N]  48.5,93.68 270 top
Q9  BCP56-16.115  [SOT230P700X180-4N]  41.83,103.5 180 top
Q10  MMBT5401  [SOT23-BEC]  60.44,101.47 180 top
Q11  MMBT5401  [SOT23-BEC]  64.69,101.41 180 top
Q12  MMBT5551  [SOT23-BEC]  60.75,91.5 90 top
Q13  MMBT5551  [SOT23-BEC]  69.39,101.35 180 top
Q14  BSS84P  [SOT95P237X112-3N]  55.36,102.93 270 top
Q15  2N7002  [SOT103P240X110-3N]  73.77,101.35 270 top
Q16  MMBT5551  [SOT23-BEC]  17.57,87.69 90 top
Q17  MMBT5401  [SOT23-BEC]  9.45,86.17 270 top
Q18  MMBT5551  [SOT23-BEC]  17.45,130.68 0 top
Q19  MMBT5551  [SOT23-BEC]  15.54,113.22 180 top
Q20  BTA26-600  [TOP3S-1]  48.12,13.4 0 top
Q21  BTA26-600  [TOP3S-1]  48.12,16.45 180 top
Q22  IRLL014N  [SOT223]  88.38,10.16 180 top
Q23  IRLML2246TRPBF  [SOT95P237X112-3N]  197.47,15.94 90 top
Q24  IRLML2246TRPBF  [SOT95P237X112-3N]  149.59,55.37 180 top
Q25  IRLML2246TRPBF  [SOT95P237X112-3N]  158.54,16.95 0 top
Q26  IRLML2246TRPBF  [SOT95P237X112-3N]  113.46,67.06 0 top
Q27  2N7002  [SOT103P240X110-3N]  283.45,61.21 180 top
Q28  IRLML2246TRPBF  [SOT95P237X112-3N]  303.13,23.75 270 top
Q29  2N7002  [SOT103P240X110-3N]  275.19,28.07 270 top
Q30  2N7002  [SOT103P240X110-3N]  271,27.94 270 top
R1  12K  [R1206]  131.62,139 90 top
R2  R010/2W  [R2512]  102.28,107.89 0 top
R3  0R  [R0805]  87.23,108.08 180 top
R4  1K  [R0805]  130.73,101.09 0 top
R5  100R  [R0805]  97.97,91.95 90 top
R6  100R  [R0805]  89.71,98.93 90 top
R7  47K  [R0805]  106.86,120.02 90 top
R8  10R  [R1206]  107.24,95.25 0 top
R9  10K  [R0805]  99.43,120.27 0 top
R10  10K  [R0805]  96.5,116.84 270 top
R11  100K  [R0805]  94.54,116.84 270 top
R12  330K  [R0805]  96.5,120.78 90 top
R13  n.c.  [R0805]  94.54,120.78 270 top
R14  100K  [R0805]  87.23,110.11 180 top
R15  4K7  [R0805]  102.41,123.25 90 top
R16  47K  [R0805]  95.23,129.54 270 top
R17  2K2  [R0805]  93.27,129.54 90 top
R18  10R  [R1206]  99.36,148.15 180 top
R19  47K  [R0805]  106.73,136.91 0 top
R20  470R  [R0805]  81.65,146.75 0 top
R21  0R  [R0805]  7.16,141.03 270 top
R22  10K  [R0805]  106.67,142.62 90 top
R23  10K  [R0805]  109.65,141.41 180 top
R24  51K  [R0805]  106.73,132.46 180 top
R25  16K  [R0805]  69.07,146.81 0 top
R26  5K6  [R0805]  106.73,138.87 0 top
R27  5K1  [R0805]  73.01,146.81 0 top
R28  1K8  [R0805]  110.67,138.87 180 top
R29  10K  [R0805]  71.87,138.3 0 top
R30  R080/3W  [R2512]  46.98,83.06 180 top
R31  2R2/2W  [R2512]  42.72,87.69 180 top
R32  2K2  [R0805]  57.64,85.53 270 top
R33  1K  [R0805]  48.18,79.5 0 top
R34  2K2  [R0805]  33.77,84.26 270 top
R35  2K2  [R0805]  37.96,93.28 90 top
R36  16K  [R0805]  59.61,85.53 270 top
R37  2K2  [R0805]  29.58,118.11 180 top
R38  220R  [R0805]  60.82,104.65 0 top
R39  220R  [R0805]  64.75,104.65 0 top
R40  470R  [R0805]  71.3,85.34 0 top
R41  1K  [R0805]  50.91,103.82 90 top
R42  220R  [R0805]  48.63,103.82 270 top
R43  100R  [R0805]  71.3,87.31 180 top
R44  7K5 0.1%  [R0805]  39.1,120.27 180 top
R45  10K  [R0805]  34.08,115.19 0 top
R46  2K2  [R0805]  63.55,85.53 90 top
R47  750R  [R0805]  61.58,85.53 90 top
R48  220R  [R0805]  39.1,127.06 0 top
R49  100K 0.1%  [R0805]  34.08,120.27 180 top
R50  20K 0.1%  [R0805]  29.58,120.27 180 top
R51  51K  [R0805]  67.36,87.31 0 top
R52  10K  [R0805]  43.16,126.05 270 top
R53  470R  [R0805]  59.55,96.14 270 top
R54  10K  [R0805]  43.16,117.3 270 top
R55  7K5 0.1%  [R0805]  43.16,121.22 90 top
R56  1K8  [R0805]  69.83,104.65 180 top
R57  0R  [R0805]  55.1,119.13 180 top
R58  220R  [R0805]  39.1,115.76 0 top
R59  100K 0.1%  [R0805]  39.1,124.9 180 top
R60  20K 0.1%  [R0805]  29.58,124.9 180 top
R61  10K  [R0805]  34.08,122.42 0 top
R62  2K2  [R0805]  29.58,127.06 0 top
R63  180R 0.1%  [R0805]  22.34,87.06 270 top
R64  2K37 0.1%  [R0805]  24.37,87.06 90 top
R65  2K2  [R0805]  29.21,106.22 180 top
R66  51R 0.1%  [R0805]  26.4,87.06 90 top
R67  51R 0.1%  [R0805]  26.4,83.12 90 top
R68  2K2  [R0805]  20.87,99.19 180 top
R69  R020/2W  [R2512]  27.67,78.87 0 top
R70  51R 0.1%  [R0805]  28.5,87.06 90 top
R71  51R 0.1%  [R0805]  28.5,83.12 90 top
R72  2K37 0.1%  [R0805]  24.94,96.46 180 top
R73  180R 0.1%  [R0805]  28.88,96.46 180 top
R74  1K  [R0805]  22.84,101.16 180 top
R75  10K  [R0805]  18.91,101.16 180 top
R76  10K  [R0805]  21.38,103.44 0 top
R77  100K  [R0805]  55.36,105.98 0 top
R78  10K  [R0805]  52.05,100.33 0 top
R79  100K  [R0805]  73.77,104.65 0 top
R80  220R  [R0805]  32.12,132.72 90 top
R81  220R  [R0805]  39.93,132.72 90 top
R82  1K  [R0805]  16.56,121.35 180 top
R83  220R  [R0805]  43.86,132.72 90 top
R84  220R  [R0805]  35.99,132.72 90 top
R85  10R  [R1206]  44.44,146.18 180 top
R86  10K  [R0805]  55.61,125.09 0 top
R87  330R  [R0805]  6.27,86.17 270 top
R88  5K1  [R0805]  60.06,132.78 270 top
R89  47K  [R0805]  68.37,121.28 0 top
R90  47K  [R0805]  17.7,84.65 180 top
R91  47K  [R0805]  13.38,87.12 0 top
R92  5K6  [R0805]  58.09,132.78 90 top
R93  750R  [R0805]  6.27,90.11 270 top
R94  2K2  [R0805]  68.37,123.25 180 top
R95  1K  [R0805]  4.3,94.04 270 top
R96  2K2  [R0805]  4.3,90.11 270 top
R97  5K6  [R0805]  62.91,116.78 0 top
R98  10K  [R0805]  13.57,131.57 180 top
R99  10K  [R0805]  15.99,127.19 0 top
R100  750R  [R0805]  19.54,115.7 270 top
R101  5K1  [R0805]  63.36,132.78 270 top
R102  4K7  [R0805]  62.91,118.75 180 top
R103  47K  [R0805]  15.99,125.22 180 top
R104  5K6  [R0805]  65.33,132.78 90 top
R105  330R  [R0805]  16.56,118.68 0 top
R106  10K  [R0805]  34.53,108.65 0 top
R107  15R/7W  [R_0913]  27.67,10.54 270 top
R108  330R/2W  [R2512]  15.92,6.73 270 top
R109  330R/2W  [R2512]  19.86,6.73 270 top
R110  2K2  [R0805]  52.63,5.97 0 top
R111  2K2  [R0805]  39.1,20.64 90 top
R112  330R/2W  [R2512]  65.96,16.19 270 top
R113  49R9  [R0805]  82.09,17.14 90 top
R114  220R  [R0805]  82.09,21.08 90 top
R115  330R/2W  [R2512]  65.96,5.71 90 top
R116  49R9  [R0805]  82.6,7.43 90 top
R117  220R  [R0805]  82.6,11.37 90 top
R118  16K  [R0805]  66.22,35.69 270 top
R119  2K2  [R0805]  66.22,39.62 270 top
R120  10R  [R1206]  84.95,32.83 90 top
R121  5K6  [R0805]  71.61,25.59 180 top
R122  2K2  [R0805]  76.5,23.56 180 top
R123  16K  [R0805]  76.5,25.53 0 top
R124  10K  [R0805]  65.64,28.7 180 top
R125  10K  [R0805]  65.64,26.73 0 top
R126  1K8  [R0805]  71.61,27.56 0 top
R127  100R  [R0805]  91.17,35.18 90 top
R128  47K  [R0805]  94.79,12.57 180 top
R129  1K  [R0805]  86.22,18.8 180 top
R130  5K6  [R0805]  93.33,62.55 90 top
R131  10K  [R0805]  91.36,62.55 270 top
R132  22R  [R0805]  44.5,63.63 180 top
R133  22R  [R0805]  44.5,65.6 180 top
R134  4K7  [R0805]  197.47,12.76 0 top
R135  4K7  [R0805]  154.67,16.65 270 top
R136  1R  [R0805]  179.5,25.97 270 top
R137  4K7  [R0805]  152.96,55.5 90 top
R138  1K8  [R0805]  158.1,65.98 0 top
R139  4K7  [R0805]  110.03,67.06 270 top
R140  1R  [R0805]  125.84,45.78 90 top
R141  4K7  [R0805]  256.52,28.19 0 top
R142  180R  [R0805]  292.91,49.15 270 top
R143  100K  [R0805]  287.83,60.77 180 top
R144  4K7  [R0805]  267.95,27.43 90 top
R145  4K7  [R0805]  253.1,27.18 90 top
R146  49R9  [R0805]  209.98,21.91 180 top
R147  10K  [R0805]  301.42,49.72 90 top
R148  49R9  [R0805]  209.98,19.94 0 top
R149  49R9  [R0805]  209.98,17.97 180 top
R150  49R9  [R0805]  209.98,16 0 top
R151  10R  [R1206]  303.13,19.18 270 top
R152  12K4  [R0805]  219.19,9.21 0 top
R153  10K  [R0805]  303.13,29.53 0 top
R154  100K  [R0805]  303.13,26.8 180 top
R155  180R  [R0805]  214.55,5.02 180 top
R156  180R  [R0805]  214.55,3.05 180 top
R157  10K  [R0805]  229.35,4.76 90 top
R158  180R  [R0805]  199.88,49.66 0 top
R159  1K8  [R0805]  198.93,60.58 180 top
R160  750R  [R0805]  183.5,52.2 0 top
R161  750R  [R0805]  187.5,52.2 0 top
R162  47K  [R0805]  275.19,31.31 180 top
R163  47K  [R0805]  271.07,31.31 180 top
R164  100R  [R0805]  180.32,63.82 180 top
R165  5K1  [R0805]  184.9,41.4 0 top
R166  5K1  [R0805]  180.96,41.4 0 top
R167  1K  [R0805]  189.41,65.79 90 top
R168  1K  [R0805]  198.1,65.21 180 top
R169  4K7  [R0805]  246.87,29.78 90 top
R170  10K  [R0805]  244.9,29.78 90 top
R171  4K7  [R0805]  236.01,29.78 90 top
R172  10K  [R0805]  237.98,29.78 90 top
RN1  4x10K  [CAY16]  229.35,18.86 0 top
RN2  4x10K  [CAY16]  225.85,18.86 0 top
SAR1  CG2-470L  [SAR]  18.91,27.47 180 top
SH1  Pgnd to Pout- short  [SHORT_NOHOLE]  94.85,82.93 180 top
SH2  Sgnd to Pgnd short  [SHORT_NOHOLE]  94.79,82.74 270 top
SH3  [SHORT_NOHOLE]  224.9,10.35 180 top
SP1  LD-BZEN-0903  [LD-BZEN-0903]  276.02,64.14 0 top
SW  S1751-46R  [S1751-46R]  131.11,104.97 90 top
SW1  A101SYCQ04  [M9040P]  304.5,10 0 bottom
SW2  1301.9316  [TACTM-6XN]  304.5,37 270 bottom
TP1  [TP_1.1MM]  16.56,97.66 270 top
TP2  [TP_1.1MM]  173.8,9.54 180 top
TP3  [TP_1.1MM]  136.1,9.4 180 top
TR1  SRF0703-821M  [SRF0703]  90.54,141.54 0 top
TR2  VTX-214-005-112 (or MYRRA 47154)  [PCB_ACDC_MYRRA_5W]  44.12,39.31 270 top
U$1  [RECYCLE_BIN1/8]  20.63,17.78 0 top
U$2  [RECYCLE_BIN1/8]  124.26,106.36 0 top
U$3  [PB_SMALL]  122.61,109.6 0 top
U$4  [ESD_SYMBOL]  121.62,113.39 0 top
U$5  [PB_SMALL]  34.66,20.57 0 top
U$6  [ESD_SYMBOL]  25.61,17.76 0 top
U$7  [ESD_SYMBOL]  115.46,20.93 0 top
U$8  [RECYCLE_BIN1/8]  125.91,21.34 0 top
U$9  [PB_SMALL]  123.94,24.77 0 top
VAR1  S20K250  [VARISTOR]  18.4,39.37 0 top
VAR2  S20K250  [VARISTOR]  18.4,34.35 180 top
WIFI  NRF24L01 module  [MOD-NRF24L01_MIRROR]  303.51,55.37 0 top
X1  39303035  [MINIFIT_6659-3]  136.19,88.84 0 bottom
X2  282836-2  [TBLOCK5.0_2]  144.38,141.54 180 bottom
X3  SSW-113-02-T-D-RA  [SSW-113-02-T-D-RA]  12.51,97.83 90 top
X4  39303055  [MINIFIT_6659-5]  13.26,61.72 0 top
X5  09185107324  [IDC-10PIN]  95.03,50.13 90 top
X6  22-23-2031  [22-23-2031]  95.81,35.37 90 top
X7  LMJ2138814S0L1T1C  [RJ45-VERT]  79.53,59.12 180 bottom
X8  826629-8  [SSW-108-02-S-S]  80.06,71.12 0 top
X9  826629-5  [SSW-105-02-S-S]  48.88,71.12 180 top
X10  826629-5  [SSW-105-02-S-S]  30.15,71.12 180 top
X11  2411-01  [KUSBVX-BS1N]  54.73,59.12 0 bottom
X12  MC000006  [MC000006_MIRROR]  182,34 180 top
X13  TSW-113-07-F-D  [TSW-113-07-F-D]  175.25,21.83 90 top
X14  MC000005  [MC000005_MIRROR]  114,34 180 top
X15  TSW-113-07-F-D  [TSW-113-07-F-D]  134.25,52.17 270 top
X16  09185067324  [IDC-10PIN]  277.8,5.21 0 top
X17  22-23-2021  [22-23-2021]  261.22,4.19 0 top
X18  MC34753  [SSW-108-02-S-S]  202.93,14.54 90 top
X19  22-23-2041  [22-23-2041]  253.6,4.19 0 top
X20  SSW-105-02-S-D  [SSW-105-02-S-D]  244.21,13.27 90 top
Y1  32,768kHz  [R26_XTAL]  259.13,50.23 0 top
Y2  25MHz  [HC-49/4H]  238.05,11.18 270 top
ZD1  n.c.  [DO214AA]  129.91,85.66 270 top
ZD2  n.c.  [DO214AA]  137.59,144.02 270 top
ZD3  See Note 3.2  [DO214AA]  10.02,94.11 180 top
ZD4  BZX384-C15.115  [SOD323-W]  53.13,79.57 180 top
ZD5  PDZ6.2B  [SOD323-W]  56.82,97.92 90 top
ZD6  1.5KE400CA  [DO201-BIDIR]  11.95,14.71 0 top
ZD7  1.5KE400CA  [DO201-BIDIR]  11.89,20.24 0 top
ZD8  P4SMAJ60A  [DO214AC]  169.72,29.15 90 top
ZD9  P4SMAJ60A  [DO214AC]  130.22,47.67 270 top
ZD10  SMAJ18A  [DO214AC]  196.77,31.62 180 top
ZD11  SMAJ18A  [DO214AC]  125.03,31.24 180 top
ZD12  4V3  [MINIMELF]  180.83,66.1 180 top

## Tracks (layer width: path | path; a pad name or v marks a point on that pad's centre or on a via)
1V2O
  Top 0.254: IC28.22 228.88,8.42 229.09,8.64 230.24,8.64 230.81,8.06 230.81,6.16 231.25,5.71 C146.2
!ADC1_SELECT  (via drill 0.6)
  Top 0.254: v246.75,34.23 246.37,33.85 235.63,33.85 234.87,34.61 222.11,34.61 221.47,33.97 217.92,33.97 217.6,33.66 212.84,33.66 212.2,33.02 IC22.4
  Bottom 0.254: v246.75,34.23 247.13,34.61 247.13,70.41 MCU.15
!ADC2_SELECT  (via drill 0.6)
  Top 0.254: v215.06,65.09 215.06,65.66 211.69,69.03 207.95,69.03 207,69.98 166.99,69.98 166.1,69.09 163.05,69.09 162.23,69.91 140.83,69.91 139.37,68.45 IC25.4
  Bottom 0.254: MCU.48 225.25,35.88 224.39,35.88 223.12,37.15 222.3,37.15 221.6,37.85 221.6,38.73 218.55,41.78 218.55,63.18 216.65,65.09 v215.06,65.09
!BP_OE  (via drill 0.6)
  Top 0.254: v211.44,72.58 211.88,73.01 281.08,73.01 MCU.10 | IC20.21 163.07,64.95 161.85,66.17 161.85,66.86 162.54,67.56 166.86,67.56 167.75,68.45 176.45,68.45 v176.96,67.94
  Bottom 0.254: v211.44,72.58 211,73.03 182.04,73.03 v176.96,67.94
!BP_OUT0  (via drill 0.6)
  Top 0.254: IC20.5 163.68,56.76 162.86,55.94 158.04,55.94 155.5,58.48 154.35,58.48 150.42,62.42 v150.42,62.99
  Bottom 0.254: LED_CV1.C 120.22,62.17 128.95,62.17 129.78,62.99 v150.42,62.99
!BP_OUT1  (via drill 0.6)
  Top 0.254: IC20.6 164.34,56.02 165.75,54.61 168.26,54.61 170.93,57.28 194.87,57.28 v195.25,57.66 | Q23.1 196.53,15.16 196.26,15.43 v196.01,15.43
  Top 0.406: Q23.1 196.53,12.77 R134.1
  Bottom 0.254: v196.01,15.43 196.01,44.96 195.38,45.59 195.38,57.53 v195.25,57.66
!BP_OUT2  (via drill 0.6)
  Top 0.254: IC20.7 164.94,56.66 166.04,55.56 v167.24,55.56 | v177.47,22.48 v177.47,27.18
  Bottom 0.254: LED_O1.C 172.7,18.41 173.53,19.24 176.71,19.24 177.47,20 v177.47,22.48 | v177.47,27.18 177.47,31.94 176.13,33.27 171.31,33.27 170.55,34.04 170.55,52.26 v167.24,55.56
!BP_OUT3  (via drill 0.6)
  Top 0.254: IC20.8 165.61,57.33 v166.16,56.77
  Bottom 0.254: v166.16,56.77 166.16,55.24 169.91,51.5 169.91,33.15 156.05,19.29 LED_SP.C
!BP_OUT4  (via drill 0.6)
  Top 0.254: IC20.9 166.22,59.3 166.55,59.63 188.33,59.63 189.28,60.58 195.63,60.58 v196.2,60.01
  Bottom 0.254: 197.13,46.95 LED_PROG1.C 197.45,47.07 196.71,47.82 196.71,59.5 v196.2,60.01 196.33,59.88
!BP_OUT5  (via drill 0.6)
  Top 0.254: IC20.10 166.88,57.33 167.81,56.39 169.21,56.39 170.67,57.85 190.55,57.85 v190.99,58.29
  Bottom 0.254: LED_S1.C 189.95,51.98 190.99,53.02 v190.99,58.29
!BP_OUT6  (via drill 0.6)
  Top 0.254: IC20.11 167.49,57.54 168.01,57.02 169.02,57.02 170.42,58.42 189.28,58.42 v189.6,58.74
  Bottom 0.254: LED_CC1.C 189.7,54.06 189.66,54.1 189.66,58.67 v189.6,58.74
!BP_OUT7  (via drill 0.6)
  Top 0.254: IC20.12 168.15,58.94 168.2,58.99 188.52,58.99 189.22,59.69 190.55,59.69 v190.61,59.63
  Bottom 0.254: LED_CV2.C 189.7,60.54 v190.61,59.63
!BP_OUT8  (via drill 0.6)
  Top 0.254: 154.96,17.89 155.48,17.89 155.56,17.97 155.56,21.91 v154.1,23.37 | IC20.13 v169.09,63.75
  Top 0.406: Q25.1 154.96,17.89 R135.1
  Bottom 0.254: v154.1,23.37 155.43,23.37 169.21,37.15 169.21,51.37 165.21,55.37 165.21,58.04 168.83,61.66 168.83,63.5 v169.09,63.75
!BP_OUT9  (via drill 0.6)
  Top 0.254: R137.1 154.04,54.55 v154.1,54.61 | IC20.14 167.49,62.5 v167.94,62.04
  Top 0.406: Q24.1 152.84,54.43 R137.1
  Bottom 0.254: v154.1,54.61 155.31,53.4 162.99,53.4 164.64,55.05 164.64,58.23 167.94,61.53 v167.94,62.04
!BP_OUT10  (via drill 0.6)
  Top 0.254: IC20.15 166.88,65.35 v166.93,65.41
  Bottom 0.254: v166.93,65.41 166.86,65.41 165.97,66.29 165.15,66.29 164.64,65.79 164.64,65.22 162.42,62.99 157.91,62.99 156.32,61.4 150.67,61.4 149.59,62.48 130.1,62.48 129.21,61.59 127.68,61.59 120.09,54 LED_CC2.C 119.1,53.95
!BP_OUT12  (via drill 0.6)
  Top 0.254: IC20.17 165.61,65.39 v165.59,65.41
  Bottom 0.254: v165.59,65.41 162.54,62.36 158.1,62.36 156.58,60.83 150.48,60.83 149.34,61.98 130.41,61.98 129.46,61.02 127.94,61.02 119.05,52.14 LED_S2.C
!BP_OUT13  (via drill 0.6)  (1 unrouted)
  Top 0.254: v139.56,37.27 139.56,50.48 142.16,53.09 145.78,53.09 146.8,54.1 146.8,57.15 v148.57,58.93 | IC20.18 164.96,62.67 163.69,61.4 161.91,61.4 v161.4,60.9
  Bottom 0.254: LED_O2.C 136.8,18.39 138.29,19.88 138.29,36.01 v139.56,37.27 | v148.57,58.93 149.46,59.82 157.08,59.82 158.48,61.21 161.08,61.21 v161.4,60.9
!BP_OUT14  (via drill 0.6)
  Top 0.254: 112.43,68 Q26.1 112.11,68 112.06,67.94 112.06,70.29 112.7,70.93 v120.44,70.93 | v163.94,71.06 163.5,71.5 127.3,71.5 v126.54,70.74 | IC20.19 164.34,64.72 164.7,65.09 164.7,66.17 164.32,66.55 v162.8,66.55
  Top 0.406: Q26.1 110.04,68 R139.1
  Bottom 0.254: v163.94,71.06 163.94,67.69 v162.8,66.55 | v120.44,70.93 126.35,70.93 v126.54,70.74
!BP_OUT15  (via drill 0.6)
  Top 0.254: v301.04,20.95 v301.04,20.96 300.15,21.84 290.43,21.84 v289.67,22.61 | v231,37.97 231.51,37.47 262.75,37.47 264.46,35.75 284.02,35.75 284.53,35.24 285.55,35.24 286.75,34.04 v287,34.04 | v165.28,71.06 165.66,71.5 208.33,71.5 v208.71,71.12 | v163.69,65.6 163.69,63.77 IC20.20
  Bottom 0.254: v289.67,22.61 289.67,22.67 289.99,22.99 289.99,26.48 288.97,27.5 288.97,28.57 287.64,29.91 287.64,32.07 287,32.7 v287,34.04 | v231,37.97 231,46.48 231.7,47.18 231.7,69.53 230.68,70.55 226.3,70.55 225.85,70.1 220.84,70.1 219.25,68.52 213.98,68.52 212.07,70.42 209.41,70.42 v208.71,71.12 | v163.69,65.6 163.69,65.66 163.81,65.79 163.81,66.74 164.51,67.44 164.51,70.29 v165.28,71.06 | LED_PWR.C 301.08,21 v301.04,20.95
!CH1_ADC  (via drill 0.6)  (1 unrouted)
  Top 0.254: IC22.13 204.52,33.02 v204.26,32.83 | 172.71,47.24 173.97,48.51 175.75,48.51 176.51,47.75 176.51,46.93 178.8,44.64 200.84,44.64 v201.34,44.13
  Bottom 0.254: v204.26,32.83 203.88,33.21 203.88,38.73 201.66,40.96 201.66,43.81 v201.34,44.13
!CH1_DAC  (1 unrouted)
  Top 0.254: IC21.12 203.57,47.82 202.11,46.35 180.77,46.35 180.01,47.12 178.8,47.12 176.64,49.28 176.64,50.16 175.75,51.05 173.97,51.05 172.71,49.78
!CH1_EXPANDER  (1 unrouted)
  Top 0.254: 204.2,46.55 203.44,46.55 202.68,45.78 180.52,45.78 179.75,46.55 178.55,46.55 175.32,49.77 X13.3
!CH1_INT
  Top 0.254: IC22.11 204.77,35.56 203.88,36.45 203.88,38.29 198.68,43.5 178.29,43.5 175.82,45.97 174,45.97 X13.8
!CH1_RESET  (via drill 0.6)
  Top 0.254: IC22.14 v203.44,31.75 | X13.5 175.39,47.23 178.55,44.07 199.5,44.07 v200.33,43.24
  Bottom 0.254: v203.44,31.75 203.31,31.88 203.31,38.48 201.09,40.7 201.09,42.48 v200.33,43.24
!CH2_ADC  (via drill 0.6)
  Top 0.254: X15.6 136.57,26.8 135.3,28.07 133.84,28.07 133.14,27.37 117.4,27.37 116.38,28.38 v116.38,28.83 | v104.51,56.13 106.35,54.29 129.08,54.29 133.14,58.36 136.64,58.36 139.37,61.09 IC25.13
  Bottom 0.254: v116.38,28.83 116.06,28.51 107.55,28.51 103.81,32.26 103.81,55.44 v104.51,56.13
!CH2_DAC  (via drill 0.6)
  Top 0.254: IC23.12 121.78,60.26 120.44,58.93 108.44,58.93 v108.38,58.86 | X15.4 136.64,24.26 135.37,22.99 133.72,22.99 132.45,24.26 113.46,24.26 107.55,30.16 v107.55,30.67
  Bottom 0.254: v107.55,30.67 106.98,30.67 104.95,32.7 104.95,54.42 108.38,57.85 v108.38,58.86
!CH2_EXPANDER  (via drill 0.6)
  Top 0.254: IC23.13 123.05,59.69 121.4,58.04 109.39,58.04 v109.33,57.98 | X15.3 133.27,24.26 132.7,24.83 113.71,24.83 108.51,30.04 108.51,31.11 v107.55,32.07
  Bottom 0.254: v107.55,32.07 106.47,32.07 105.52,33.02 105.52,54.17 v109.33,57.98
!CH2_INT  (via drill 0.6)
  Top 0.254: IC23.11 120.51,60.26 120.06,59.82 v107.49,59.82 | v115.43,29.84 117.65,29.84 118.98,28.51 131.81,28.51 133.91,30.61 134.86,30.61 136.12,29.34 X15.8
  Bottom 0.254: v115.43,29.84 114.67,29.08 107.75,29.08 104.38,32.45 104.38,54.67 107.43,57.72 107.43,59.75 v107.49,59.82
!CH2_RESET  (via drill 0.6)
  Top 0.254: X15.5 115.74,26.8 109.2,33.34 v109.2,35.37 | v109.2,53.34 109.59,53.72 129.33,53.72 133.4,57.78 136.89,57.78 140.64,61.53 IC25.14
  Bottom 0.254: v109.2,35.37 v109.2,53.34
!CONVEND1  (via drill 0.6)  (1 unrouted)
  Top 0.254: IC22.6 214.93,35.56 219.06,39.69 225.6,39.69 226.49,40.58 233.16,40.58 v233.54,40.2
  Bottom 0.254: v233.54,40.2 233.54,46.48 232.9,47.12 232.9,71.44
!CONVEND2  (via drill 0.6)
  Top 0.254: IC23.6 120.51,68.52 125.02,73.03 209.66,73.03 211.06,71.63 212.33,71.63 v212.77,72.07
  Bottom 0.254: MCU.20 235.41,71.44 234.49,71.44 232.9,73.01 213.71,73.01 v212.77,72.07
!DAC1_SELECT  (via drill 0.6)  (2 unrouted)
  Top 0.254: v223.63,49.85 220.46,49.85 219.31,48.7 211.63,48.7 210.74,47.82 209.47,47.82 | v243.51,51.05 243.13,51.44 229.09,51.44 227.51,49.85 v227.19,49.85
  Bottom 0.254: v223.63,49.85 v227.19,49.85 | 245.6,71.44 243.63,69.47 243.63,51.18 v243.51,51.05
!DAC2_SELECT  (via drill 0.6)
  Top 0.254: IC23.5 121.78,68.52 125.78,72.52 209.41,72.52 210.81,71.12 212.65,71.12 215.88,67.88 216.96,67.88 217.6,67.25 v217.6,66.04
  Bottom 0.254: MCU.47 222.73,38.49 219.12,42.1 219.12,63.44 217.98,64.58 217.98,65.66 v217.6,66.04
!DP_DRIVE
  Top 0.406: R41.1 50.91,100.84 | 50.91,100.84 50.91,100.52 R78.1 | Q9.1 50.56,101.19 50.91,100.84
!EEPROM_SELECT  (via drill 0.6)  (1 unrouted)
  Top 0.254: MCU.49 222.78,35.85 224.08,37.15 227.31,37.15 v227.82,37.66 | v229.41,49.47 240.4,49.47 242.3,47.56
  Bottom 0.254: v229.41,49.47 229.28,49.34 229.28,39.37 227.82,37.91 v227.82,37.66
!ETH_IRQ  (via drill 0.6)  (1 unrouted)
  Top 0.254: v303.01,69.6 242.33,69.6 MCU.18 | IC28.36 231.59,14.69 232.52,15.62 234.17,15.62 v235.57,17.02
  Bottom 0.254: WIFI.8 306.06,67.12 303.58,69.6 v303.01,69.6 | X20.8 242.87,15.88 236.71,15.88 v235.57,17.02 235.57,21.4 236.71,22.54 236.71,25.15 237.86,26.29 237.86,30.48 239.82,32.45 239.82,46.67 240.52,47.37 240.52,71.37
!ETH_SELECT  (via drill 0.6)  (1 unrouted)
  Top 0.254: IC28.32 235.18,12.69 v235.57,13.08 | v245.6,67.44 245.98,67.06 251.44,67.06 252.78,68.39 271.45,68.39 272.91,66.93 274.18,66.93 275.13,67.88 278.5,67.88 279.32,67.06 280.46,67.06 281.86,68.45 284.72,68.45 v285.16,68.07